# Altium schematic sheet PDB.SchDoc
size A4; SheetNumber: 1; SheetTotal: 3
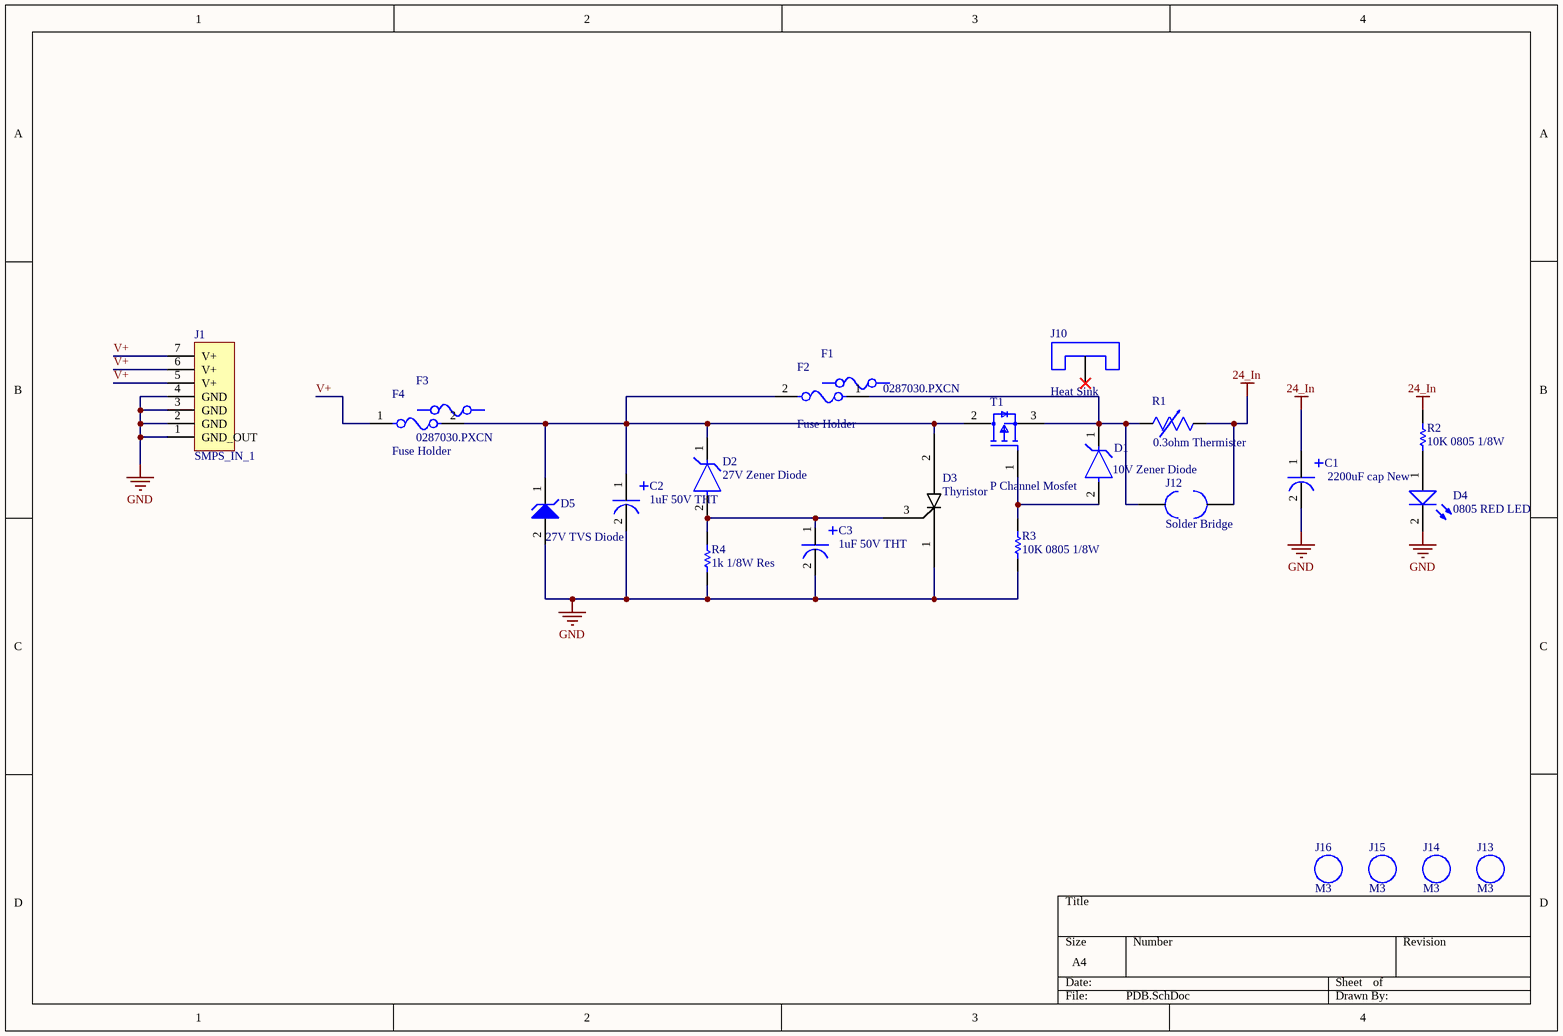
[diagram p0: PDB.SchDoc]

## Parts
C1  2200uF cap New  [Capacitor through hole]
C2  1uF 50V THT  [capacitor Through Hole Small]
C3  1uF 50V THT  [capacitor Through Hole Small]
D1  10V Zener Diode  [27V Zener diode]
D2  27V Zener Diode  [27V Zener diode]
D3  Thyristor  [Thyristor]
D4  0805 RED LED  [0805 LED]
D5  27V TVS Diode  [27V TVS Diode]
F1  0287030.PXCN  [FP-0287-MFG]  (mechanical)
F2  Fuse Holder  [FUSE HOLDER]
F3  0287030.PXCN  [FP-0287-MFG]  (mechanical)
F4  Fuse Holder  [FUSE HOLDER]
J1  SMPS_IN_1  [7 LUG PIN HEADER]
J10  Heat Sink  [Heat Sink]
J12  Solder Bridge  [1206]
J13  M3  [M3]
J14  M3  [M3]
J15  M3  [M3]
J16  M3  [M3]
R1  0.3ohm Thermister  [thermistor]
R2  10K 0805 1/8W  [0805 1K Resistor]
R3  10K 0805 1/8W  [0805 1K Resistor]
R4  1k 1/8W Res  [0805 1K Resistor]
T1  P Channel Mosfet  [P-Ch Mosfet]

## Nets
24_In: C1.1 J12.2 R1.1 R2.2
GND: C1.2 C2.2 C3.2 D3.1 D4.2(K) D5.2(A) J1.1(GND_OUT) J1.2(GND) J1.3(GND) J1.4(GND) R3.1 R4.1
V+: F4.1 J1.5(V+) J1.6(V+) J1.7(V+)
NetC2_1: C2.1 D2.1(C) D3.2 D5.1(K) F2.2 F4.2 T1.2(D)
NetC3_1: C3.1 D2.2(A) D3.3 R4.2
NetD1_1: D1.1(C) F2.1 J12.1 R1.2 T1.3(S)
NetD1_2: D1.2(A) R3.2 T1.1(G)
NetD4_1: D4.1(A) R2.1

Not connected (* = marked no-connect by the designer): J10 1*

## Library data of the parts
C1 = MAL214851222E3: Radial Can ALUMINUM ELECTROLYTIC CAPACITOR 148RUS 50V 2200muF ±20% 0.630Dia 16.00mm; Manufacturer: Vishay; Value: 2.2mF; Impedance: 39mΩ; Lead Diameter: 800µm; Leakage Current: 1.1mA; Life (Hours): 3000hours; Polarity: Polar; Ripple Current: 1.52A; Supplier: Avnet; Supplier Part Number: 40Y2495; Manufacturer Part Number: MAL214851222E3; RoHS: Compliant; Category: Aluminum Electrolytic Capacitors; Stock: 25; Pricing: 1=5.04, 10=3.42, 25=3.22, 50=3.02, 100=2.82 (USD); Case/Package: Radial; China RoHS: Compliant; Diameter: 16mm; Height: 31mm; Height - Seated (Max): 33.5026mm; Lead Pitch: 7.5mm; Length: 31mm; Lifecycle Status: Production; Max Operating Temperature: 105°C; Min Operating Temperature: -40°C; Mounting Technology: Through Hole; Number of Terminals: 2; Packaging: Bulk; Radiation Hardening: No; REACH SVHC: Yes; Terminal Pitch: 7.5mm; Termination: Radial; Tolerance: 20%; Voltage Rating: 50V; Voltage Rating (DC): 50V; ComponentLink1URL: https://datasheet.octopart.com:443/MAL214851222E3-Vishay-datasheet-159617121.pdf?src-supplier=IHS; ComponentLink1Description: https://datasheet.octopart.com:443/MAL214851222E3-Vishay-datasheet-159617121.pdf?src-supplier=IHS; ComponentLink2URL: https://datasheet.octopart.com:443/MAL214851222E3-Vishay-datasheet-62320647.pdf?src-supplier=Farnell; ComponentLink2Description: https://datasheet.octopart.com:443/MAL214851222E3-Vishay-datasheet-62320647.pdf?src-supplier=Farnell; ComponentLink3URL: https://datasheet.octopart.com:443/MAL214851222E3-Vishay-datasheet-37143530.pdf?src-supplier=Newark; ComponentLink3Description: https://datasheet.octopart.com:443/MAL214851222E3-Vishay-datasheet-37143530.pdf?src-supplier=Newark; ComponentLink4URL: http://sigma.octopart.com:80/rohs_statement/Vishay-company-15.pdf?src-supplier=Compliance+Statements; ComponentLink4Description: http://sigma.octopart.com:80/rohs_statement/Vishay-company-15.pdf?src-supplier=Compliance+Statements; LCSC Part No: C1601121
C2 C3 = 50YXF1MEFC5X11: 1uF 50V ±20% Plugin, D5xL11mm Aluminum Electrolytic Capacitors - Leaded ROHS; Manufacturer: Rubycon; Value: 1µF; Impedance: 4Ω; Leakage Current: 3µA; Life (Hours): 5000hours; Ripple Current: 10.5mA; Supplier: Farnell; Supplier Part Number: 50YXF1MEFC5X11; Manufacturer Part Number: 50YXF1MEFC5X11; RoHS: Compliant; Category: Aluminum Electrolytic Capacitors; Pricing: 5=0.121, 50=0.082, 250=0.0753, 500=0.0664 (GBP); Case/Package: Radial; Diameter: 5mm; Height: 11mm; Height - Seated (Max): 12.4968mm; Lead Pitch: 2mm; Length: 11mm; Lifecycle Status: Obsolete; Max Operating Temperature: 105°C; Min Operating Temperature: -40°C; Mounting Technology: Through Hole; Number of Terminals: 2; Packaging: Bulk; Radiation Hardening: No; REACH SVHC: Yes; Terminal Pitch: 2mm; Termination: Radial; Tolerance: 20%; Voltage Rating: 50V; Voltage Rating (DC): 50V; ComponentLink1URL: https://datasheet.octopart.com:443/50YXF1MEFC5X11-Rubycon-datasheet-182101233.pdf?src-supplier=IHS; ComponentLink1Description: https://datasheet.octopart.com:443/50YXF1MEFC5X11-Rubycon-datasheet-182101233.pdf?src-supplier=IHS; ComponentLink2URL: https://datasheet.octopart.com:443/50YXF1MEFC5X11-Rubycon-datasheet-86451560.pdf?src-supplier=Master+Electronics; ComponentLink2Description: https://datasheet.octopart.com:443/50YXF1MEFC5X11-Rubycon-datasheet-86451560.pdf?src-supplier=Master+Electronics; ComponentLink3URL: https://datasheet.octopart.com:443/50YXF1MEFC5X11-Rubycon-datasheet-12512315.pdf?src-supplier=LKR; ComponentLink3Description: https://datasheet.octopart.com:443/50YXF1MEFC5X11-Rubycon-datasheet-12512315.pdf?src-supplier=LKR; ComponentLink4URL: https://datasheet.octopart.com:443/50YXF1MEFC5X11-Rubycon-datasheet-41194730.pdf?src-supplier=Newark; ComponentLink4Description: https://datasheet.octopart.com:443/50YXF1MEFC5X11-Rubycon-datasheet-41194730.pdf?src-supplier=Newark; ComponentLink5URL: https://datasheet.octopart.com:443/50YXF1MEFC5X11-Rubycon-datasheet-11966930.pdf?src-supplier=Newark; ComponentLink5Description: https://datasheet.octopart.com:443/50YXF1MEFC5X11-Rubycon-datasheet-11966930.pdf?src-supplier=Newark; ComponentLink6URL: https://datasheet.octopart.com:443/50YXF1MEFC5X11-Rubycon-datasheet-10032391.pdf?src-supplier=Newark; ComponentLink6Description: https://datasheet.octopart.com:443/50YXF1MEFC5X11-Rubycon-datasheet-10032391.pdf?src-supplier=Newark; ComponentLink7URL: https://datasheet.octopart.com:443/50YXF1MEFC5X11-Rubycon-datasheet-8447018.pdf?src-supplier=Newark; ComponentLink7Description: https://datasheet.octopart.com:443/50YXF1MEFC5X11-Rubycon-datasheet-8447018.pdf?src-supplier=Newark; ComponentLink8URL: https://datasheet.octopart.com:443/50YXF1MEFC5X11-Rubycon-datasheet-5377913.pdf?src-supplier=Newark; ComponentLink8Description: https://datasheet.octopart.com:443/50YXF1MEFC5X11-Rubycon-datasheet-5377913.pdf?src-supplier=Newark; ComponentLink9Description: New link; ComponentLink9URL: *; LCSC Part No: C2927584
D1 = SMBJ5347B-TP: Zener Diode Independent 10V 5W Surface Mount SMB(DO-214AA; Manufacturer: MCC; Manufacturer Part Number: 3SMBJ5925B-TP; Element Configuration: Single; Forward Current: 200mA; Forward Voltage: 1.5V; Impedance: 4.5Ω; Max Power Dissipation: 3W; Max Reverse Leakage Current: 5µA; Number of Elements: 1; Peak Reverse Current: 5nA; Polarity: Unidirectional; Test Current: 37.5mA; Tolerance: 5%; Supplier: DigiKey; Supplier Part Number: 3SMBJ5925B-TPMSCT-ND; RoHS: Compliant; Category: Zener Diodes; Stock: 312932; Pricing: 1=0.49, 10=0.301, 100=0.1903, 500=0.14234, 1000=0.12681 (USD); China RoHS: Non-Compliant; Composition: Zener; Country of Origin: Mainland China, Vietnam; Export Control Classification Number (ECCN) Code: EAR99; Height: 2.44mm; Harmonized Tariff Schedule (HTS) Code: 8541.10.00.50; Introduction Date: 2007-02-15; Length: 4.7mm; Lifecycle Status: Production; Max Operating Temperature: 150°C; Min Operating Temperature: -55°C; Mounting Technology: Surface Mount; Pins: 2; Number of Terminals: 2; Power Dissipation: 3W; REACH SVHC: No; Reference Voltage: 10V; Voltage Tolerance: 5%; Width: 3.94mm; Zener Current: 37.5mA; Zener Voltage: 10V; ComponentLink1URL: https://datasheet.octopart.com:443/3SMBJ5925B-TP-MCC-datasheet-188909281.pdf?src-supplier=TME; ComponentLink1Description: https://datasheet.octopart.com:443/3SMBJ5925B-TP-MCC-datasheet-188909281.pdf?src-supplier=TME; ComponentLink2URL: https://datasheet.octopart.com:443/3SMBJ5925B-TP-MCC-datasheet-9573749.pdf?src-supplier=RS+(Formerly+Allied+Electronics); ComponentLink2Description: https://datasheet.octopart.com:443/3SMBJ5925B-TP-MCC-datasheet-9573749.pdf?src-supplier=RS+(Formerly+Allied+Electronics); LCSC Part No: C151743
D2 = SMBJ5361B-TP: Zener Diode, 27V, 5W, Do-214Aa Rohs Compliant: Yes |Micro Commercial Components SMBJ5361B-TP; Manufacturer: MCC; Element Configuration: Single; Forward Voltage: 1.2V; Impedance: 5Ω; Max Junction Temperature (Tj): 150°C; Max Reverse Leakage Current: 500nA; Number of Elements: 1; Peak Reverse Current: 500pA; Polarity: Unidirectional; Reverse Voltage: 20.6V; Test Current: 50mA; Tolerance: 5%; Supplier: Arrow Electronics; Supplier Part Number: SMBJ5361B-TP; Manufacturer Part Number: SMBJ5361B-TP; RoHS: Compliant; Category: Zener Diodes; Stock: 5; Pricing: 1=0.1196 (USD); Case/Package: SMB; China RoHS: Non-Compliant; Composition: Zener; Country of Origin: Mainland China, Vietnam; Export Control Classification Number (ECCN) Code: EAR99; Height: 2.82mm; Harmonized Tariff Schedule (HTS) Code: 8541.10.00.50; Introduction Date: 2002-04-11; Lead Free: Lead Free; Lifecycle Status: Production; Max Operating Temperature: 150°C; Max Power Dissipation: 5W; Min Operating Temperature: -55°C; Mounting Technology: Surface Mount; Pins: 2; Number of Terminals: 2; Power Dissipation: 5W; Radiation Hardening: No; REACH SVHC: No; Reference Voltage: 27V; Schedule B: 8541100050, 8541100050|8541100050|8541100050|8541100050|8541100050; Voltage Tolerance: 5%; Working Voltage: 27V; Zener Current: 50mA; Zener Voltage: 27V; ComponentLink1URL: https://datasheet.octopart.com:443/SMBJ5361B-TP-MCC-datasheet-179878967.pdf?src-supplier=element14+APAC; ComponentLink1Description: https://datasheet.octopart.com:443/SMBJ5361B-TP-MCC-datasheet-179878967.pdf?src-supplier=element14+APAC; ComponentLink2URL: https://datasheet.octopart.com:443/SMBJ5361B-TP-MCC-datasheet-133521239.pdf?src-supplier=Future+Electronics; ComponentLink2Description: https://datasheet.octopart.com:443/SMBJ5361B-TP-MCC-datasheet-133521239.pdf?src-supplier=Future+Electronics; ComponentLink3URL: https://datasheet.octopart.com:443/SMBJ5361B-TP-MCC-datasheet-13563501.pdf?src-supplier=HQonline; ComponentLink3Description: https://datasheet.octopart.com:443/SMBJ5361B-TP-MCC-datasheet-13563501.pdf?src-supplier=HQonline; ComponentLink4URL: https://datasheet.octopart.com:443/SMBJ5361B-TP-MCC-datasheet-12511215.pdf?src-supplier=Factory+Futures; ComponentLink4Description: https://datasheet.octopart.com:443/SMBJ5361B-TP-MCC-datasheet-12511215.pdf?src-supplier=Factory+Futures; ComponentLink5URL: https://datasheet.octopart.com:443/SMBJ5361B-TP-MCC-datasheet-11551749.pdf?src-supplier=Arrow+Electronics; ComponentLink5Description: https://datasheet.octopart.com:443/SMBJ5361B-TP-MCC-datasheet-11551749.pdf?src-supplier=Arrow+Electronics; LCSC Part No: C3730541
D3 = TN4015H-6I: SCR 600 V 40 A Standard Recovery Through Hole TO-220; Manufacturer: STMicroelectronics; Hold Current: 60mA; Leakage Current: 10µA; Max Junction Temperature (Tj): 150°C; Max Repetitive Reverse Voltage (Vrrm): 600V; Max RMS Current: 40A; Number of Elements: 1; Peak Non-Repetitive Surge Current: 360A; Supplier: Arrow Electronics; Supplier Part Number: TN4015H-6I; Manufacturer Part Number: TN4015H-6I; RoHS: Compliant; Category: Thyristors; Stock: 1000; Pricing: 1000=0.6362 (USD); China RoHS: Non-Compliant; Country of Origin: Mainland China; Export Control Classification Number (ECCN) Code: EAR99; Harmonized Tariff Schedule (HTS) Code: 8541.30.00.80; Introduction Date: 2016-11-28; Lifecycle Status: Production; Max Operating Temperature: 150°C; Min Operating Temperature: -40°C; Number of Terminals: 3; REACH SVHC: No; Schedule B: 8541300080; ComponentLink1URL: https://datasheet.octopart.com:443/TN4015H-6I-STMicroelectronics-datasheet-67304264.pdf?src-supplier=STMicroelectronics; ComponentLink1Description: https://datasheet.octopart.com:443/TN4015H-6I-STMicroelectronics-datasheet-67304264.pdf?src-supplier=STMicroelectronics; ComponentLink2URL: https://datasheet.octopart.com:443/TN4015H-6I-STMicroelectronics-datasheet-78772670.pdf?src-supplier=TME; ComponentLink2Description: https://datasheet.octopart.com:443/TN4015H-6I-STMicroelectronics-datasheet-78772670.pdf?src-supplier=TME; LCSC Part No: C5269098
D4 = SML-LXT0805IW-TR: Led; Red; 11MCD; 0.061IN.DIA.; SMD; 100MA; 2V Vf; 635NM; 140DEG; SMD; White Diffused; 5V Vr; Manufacturer: Lumex; Approvals: CSA, UL; Forward Current: 30mA; Forward Voltage: 2.5V; Number of Circuits: 1; Power Dissipation: 48mW; Shape: Rectangular; Test Current: 20mA; Viewing Angle: 140°; Wavelength: 628nm; Supplier: DigiKey; Supplier Part Number: 67-1552-1-ND; Manufacturer Part Number: SML-LXT0805IW-TR; RoHS: Compliant; Category: LEDs; Stock: 136451; Pricing: 1=0.2, 10=0.138, 100=0.0958, 500=0.07648, 1000=0.07007, 2000=0.06459 (USD); Case/Package: 0805; Case Code (Imperial): 0805; Case Code (Metric): 2012; China RoHS: Compliant; Color: Red; Country of Origin: Taiwan; Dominant Wavelength: 635nm; Export Control Classification Number (ECCN) Code: EAR99; Height: 800µm; Harmonized Tariff Schedule (HTS) Code: 8541.40.20.00; Illumination Color: Red; Introduction Date: 2001-01-08; Length: 2mm; Lens Color: White; Lens Style: Diffused; Lens Transparency: Diffused; Lifecycle Status: Production; Luminous Intensity: 11mcd; Max Operating Temperature: 80°C; Min Operating Temperature: -25°C; Mounting Technology: Surface Mount; Number of LEDs: 1; Pins: 2; Number of Terminals: 2; Packaging: Cut Tape; Peak Wavelength: 635nm; REACH SVHC: Yes; Reverse Voltage: 5V; Schedule B: 8541402000, 8541402000|8541402000|8541402000|8541402000|8541402000|8541402000|8541402000|8541402000|8541402000|8541402000|8541402000|8541402000|8541402000|8541402000|8541402000|8541402000|8541402000|8541402000|8541402000|8541402000|8541402000|8541402000|8541402000|85, 8541410000; Terminal Pitch: 2.1mm; Width: 1.25mm; ComponentLink1URL: https://datasheet.octopart.com:443/SML-LXT0805IW-TR-Lumex-datasheet-96443416.pdf?src-supplier=JRH+Electronics; ComponentLink1Description: https://datasheet.octopart.com:443/SML-LXT0805IW-TR-Lumex-datasheet-96443416.pdf?src-supplier=JRH+Electronics; ComponentLink2URL: https://datasheet.octopart.com:443/SML-LXT0805IW-TR-Lumex-datasheet-158251.pdf?src-supplier=Newark; ComponentLink2Description: https://datasheet.octopart.com:443/SML-LXT0805IW-TR-Lumex-datasheet-158251.pdf?src-supplier=Newark; ComponentLink3URL: https://datasheet.octopart.com:443/SML-LXT0805IW-TR-Lumex-datasheet-43153349.pdf?src-supplier=Electro+Sonic; ComponentLink3Description: https://datasheet.octopart.com:443/SML-LXT0805IW-TR-Lumex-datasheet-43153349.pdf?src-supplier=Electro+Sonic; ComponentLink4URL: https://datasheet.octopart.com:443/SML-LXT0805IW-TR.-Lumex-datasheet-17067.pdf?src-supplier=DigiKey; ComponentLink4Description: https://datasheet.octopart.com:443/SML-LXT0805IW-TR.-Lumex-datasheet-17067.pdf?src-supplier=DigiKey; ComponentLink5URL: https://datasheet.octopart.com:443/SML-LXT0805IW-TR-Lumex-datasheet-9793472.pdf?src-supplier=RS+(Formerly+Allied+Electronics); ComponentLink5Description: https://datasheet.octopart.com:443/SML-LXT0805IW-TR-Lumex-datasheet-9793472.pdf?src-supplier=RS+(Formerly+Allied+Electronics); ComponentLink6URL: https://datasheet.octopart.com:443/SML-LXT0805IW-TR-Lumex-datasheet-86237.pdf?src-supplier=RS+(Formerly+Allied+Electronics); ComponentLink6Description: https://datasheet.octopart.com:443/SML-LXT0805IW-TR-Lumex-datasheet-86237.pdf?src-supplier=RS+(Formerly+Allied+Electronics); LCSC Part No: C19171391
D5 = P6KE27ARLG: 600 Watt SUR40 Transient Voltage Suppressor, 27 V, Unidirectional; Manufacturer: onsemi; Breakdown Voltage: 27.05V; Clamping Voltage: 37.5V; Element Configuration: Single; Leakage Current: 5µA; Max Breakdown Voltage: 28.4V; Max Power Dissipation: 5W; Max Surge Current: 16A; Min Breakdown Voltage: 25.7V; Number of Channels: 1; Operating Supply Voltage: 23.1V; Peak Pulse Power: 600W; Power Line Protection: No; Test Current: 1mA; Supplier: Bison Technologies; Supplier Part Number: P6KE27ARLG-158866; Manufacturer Part Number: P6KE27ARLG; RoHS: Compliant; Category: TVS Diodes; Stock: 5900; Pricing: 100=0.06, 1000=0.06, 10000=0.06 (USD); Case/Package: Axial; China RoHS: Non-Compliant; Composition: Zener; Contact Plating: Tin; Country of Origin: Mainland China; Direction: Unidirectional; Export Control Classification Number (ECCN) Code: EAR99; Harmonized Tariff Schedule (HTS) Code: 8541.10.00.50; Introduction Date: 1999-01-01; Lead Free: Lead Free; Max Operating Temperature: 150°C; Max Reverse Leakage Current: 5µA; Min Operating Temperature: -55°C; Number of Elements: 1; Pins: 2; Number of Terminals: 2; Number of Unidirectional Channels: 1; Packaging: Tape and Reel; Peak Pulse Current: 16A; Polarity: Unidirectional; Power Dissipation: 600W; Radiation Hardening: No; REACH SVHC: No; Reverse Breakdown Voltage: 25.7V; Reverse Standoff Voltage: 23.1V; Termination: Axial; ComponentLink1URL: https://datasheet.octopart.com:443/P6KE27ARLG-ON-Semiconductor-datasheet-8361193.pdf?src-supplier=IHS; ComponentLink1Description: https://datasheet.octopart.com:443/P6KE27ARLG-ON-Semiconductor-datasheet-8361193.pdf?src-supplier=IHS; ComponentLink2URL: https://datasheet.octopart.com:443/P6KE27ARLG-ON-Semiconductor-datasheet-5320614.pdf?src-supplier=onsemi; ComponentLink2Description: https://datasheet.octopart.com:443/P6KE27ARLG-ON-Semiconductor-datasheet-5320614.pdf?src-supplier=onsemi; ComponentLink3URL: https://datasheet.octopart.com:443/P6KE27ARLG-onsemi-datasheet-79626349.pdf?src-supplier=Farnell; ComponentLink3Description: https://datasheet.octopart.com:443/P6KE27ARLG-onsemi-datasheet-79626349.pdf?src-supplier=Farnell; ComponentLink4URL: http://sigma.octopart.com:80/reach_statement/ON-Semiconductor-company-79.pdf?src-supplier=Compliance+Statements; ComponentLink4Description: http://sigma.octopart.com:80/reach_statement/ON-Semiconductor-company-79.pdf?src-supplier=Compliance+Statements; ComponentLink5URL: https://octopart.com:443/opatz8j6/c1?t=2cJTaBfKdbaYfiIibkn32kFJN2rkQAxk7M-zdmCFLNYhDS4Q_M0VQkaOAo5Ijtsf6TEss0vlvxYVSuDQTRZP4OvQV2pXsbQ98v0s9K6hdiFStXveO6nhAUnzDXp5xHxKIFKd8f_nnKbZC-l5hdBFgFSLLzjiWU1mRDFWwLSmSyFNQzmDyJ0WyQpSZN_85hCm8lhg27LncNlkqwz2W0BQiMb47LSU24ywtnWJBrffDSUFoIOy5DRvi26unpeOfRJUZq5vb6J1HvpVsqMMnuUvQDgpfylJ3jskX1SzE2wqL06L0laSWrQj0crcyI1tb60BYAje57qsLb2d2LwrmFq9ygYxyN3BPTigX2aIOQ&src-supplier=Compliance+Statements; ComponentLink5Description: https://octopart.com:443/opatz8j6/c1?t=2cJTaBfKdbaYfiIibkn32kFJN2rkQAxk7M-zdmCFLNYhDS4Q_M0VQkaOAo5Ijtsf6TEss0vlvxYVSuDQTRZP4OvQV2pXsbQ98v0s9K6hdiFStXveO6nhAUnzDXp5xHxKIFKd8f_nnKbZC-l5hdBFgFSLLzjiWU1mRDFWwLSmSyFNQzmDyJ0WyQpSZN_85hCm8lhg27LncNlkqwz2W0BQiMb47LSU24ywtnWJBrffDSUFoIOy5DRvi26unpeOfRJUZq5vb6J1HvpVsqMMnuUvQDgpfylJ3jskX1SzE2wqL06L0laSWrQj0crcyI1tb60BYAje57qsLb2d2LwrmFq9ygYxyN3BPTigX2aIOQ&src-supplier=Compliance+Statements; LCSC Part No: C3707914
F1 F3 = CMP-08605-000065-1: FUSE AUTOMOTIVE 30A 32VDC BLADE; Manufacturer: Littelfuse Inc; Max Fuse Dc Voltage: 32V; Fuse Voltage Drop: 84mV; Fuse I2T: 1510A2Sec; Fuse Blow Speed: Medium; Resistance: 1.97mΩ; Value: 1.97mΩ; Fuse Interrupt Dc Current: 1000A; Fuse Current: 30A; Device Class L2: Fuses; Octopart: https://octopart.com/0287030.pxcn-littelfuse-19644293; Device Class L3: unset; Voltage Rating: 32V; RoHS: TRUE; ComponentLink2Description: Datasheet; Device Class L1: Circuit Protection; Ambient Temperature Range High: +105°C; ComponentLink2URL: https://www.littelfuse.com/~/media/automotive/datasheets/fuses/passenger-car-and-commercial-vehicle/blade-fuses/littelfuse_atof_datasheet.pdf; Automotive: Yes; Lead Free: Yes; Ambient Temperature Range Low: -40°C; Manufacturer Part Number: 0287030.PXCN; Mouser Description: Automotive Fuses ATOF 32V 30A Low-Current Nylon; Package: 0287; Category: Fuse; Digikey Description: FUSE AUTOMOTIVE 30A 32VDC BLADE; LCSC Part No: C142686
F2 F4 = 3568: Holder; Fuse; Auto Blade; Mini; 500VAC; 30A; PC Pin Terminal; Nylon 4/6 Holder; Black; Manufacturer: Keystone; Approvals: UL; Current Rating: 20A; Illumination Type: Illuminated; Material: Brass, Nylon, Tin; Number of Circuits: 1; Voltage: 500V; Supplier: Future Electronics; Supplier Part Number: 3568; Manufacturer Part Number: 3568; RoHS: Compliant; Category: Fuse Holders; Stock: 77707; Pricing: 30=0.74, 100=0.72, 250=0.71, 1000=0.69, 2500=0.66 (USD); Body Material: Nylon; Color: Black; Contact Material: Brass; Contact Plating: Tin; Country of Origin: USA; Depth: 6.73mm; Flammability Rating: UL94 V-0; Fuse Current: 20A; Introduction Date: 2015-08-28; Lead Free: Lead Free; Length: 16mm; Lifecycle Status: Production; Max Operating Temperature: 145°C; Min Operating Temperature: -50°C; Mounting Technology: PCB, Vertical; Number of Poles: 1; Orientation: Vertical; REACH SVHC: Yes; Termination: PC Pin; Voltage Rating (AC): 500V; ComponentLink1URL: https://datasheet.octopart.com:443/3568-Keystone-datasheet-137335555.pdf?src-supplier=Upverter; ComponentLink1Description: https://datasheet.octopart.com:443/3568-Keystone-datasheet-137335555.pdf?src-supplier=Upverter; ComponentLink2URL: https://datasheet.octopart.com:443/3568-Keystone-datasheet-15715963.pdf?src-supplier=Future+Electronics; ComponentLink2Description: https://datasheet.octopart.com:443/3568-Keystone-datasheet-15715963.pdf?src-supplier=Future+Electronics; ComponentLink3URL: https://datasheet.octopart.com:443/3568-Keystone-datasheet-7589202.pdf?src-supplier=Future+Electronics; ComponentLink3Description: https://datasheet.octopart.com:443/3568-Keystone-datasheet-7589202.pdf?src-supplier=Future+Electronics; ComponentLink4URL: https://datasheet.octopart.com:443/3568-Keystone-datasheet-137916591.pdf?src-supplier=Future+Electronics; ComponentLink4Description: https://datasheet.octopart.com:443/3568-Keystone-datasheet-137916591.pdf?src-supplier=Future+Electronics; ComponentLink5URL: https://datasheet.octopart.com:443/3568-Keystone-datasheet-21202853.pdf?src-supplier=element14+APAC; ComponentLink5Description: https://datasheet.octopart.com:443/3568-Keystone-datasheet-21202853.pdf?src-supplier=element14+APAC; ComponentLink6URL: https://datasheet.octopart.com:443/3568-Keystone-datasheet-10928834.pdf?src-supplier=RS+(Formerly+Allied+Electronics); ComponentLink6Description: https://datasheet.octopart.com:443/3568-Keystone-datasheet-10928834.pdf?src-supplier=RS+(Formerly+Allied+Electronics); ComponentLink7URL: https://datasheet.octopart.com:443/3568-Keystone-datasheet-110727069.pdf?src-supplier=RS+(Formerly+Allied+Electronics); ComponentLink7Description: https://datasheet.octopart.com:443/3568-Keystone-datasheet-110727069.pdf?src-supplier=RS+(Formerly+Allied+Electronics); ComponentLink8URL: https://datasheet.octopart.com:443/3568-Keystone-datasheet-17577430.pdf?src-supplier=TME; ComponentLink8Description: https://datasheet.octopart.com:443/3568-Keystone-datasheet-17577430.pdf?src-supplier=TME; LCSC Part No: C5249699
J1 = Terminal Connectors 6: 5.08mm Pitch Eurostyle Vertical Fixed Mount PCB Terminal Block, 6 Circuits; Manufacturer: Molex; Manufacturer Part Number: 39544-3006; Manufacturer Lifecycle Status: ACTIVE; Approvals: UL, cUL; Current Rating: 15A; Number of Circuits: 5; Number of Contacts: 6; Number of Levels: 1; Voltage Rating: 300V; Wire/Cable Gauge: 12AWG; Supplier: Arrow Electronics; Supplier Part Number: 0395443006; RoHS: Compliant; Category: Terminal Blocks; Stock: 960; Pricing: 1=2.8662, 10=2.1815, 25=1.9364, 50=1.7714, 100=1.6311, 480=1.4072, 960=1.353 (USD); China RoHS: Compliant; Color: Black; Contact Material: Brass; Contact Plating: Tin; Country of Origin: US; Export Control Classification Number (ECCN) Code: EAR99; ELV: Compliant; Flammability Rating: UL94 V-0; Halogen Free: Low Halogen; Height: 14.4mm; Housing Color: Black; Housing Material: Nylon; Harmonized Tariff Schedule (HTS) Code: 8536.90.40.00; Introduction Date: 2007-04-03; Lead Free: Lead Free; Length: 30.48mm; Lifecycle Status: Production; Max Operating Temperature: 105°C; Min Operating Temperature: -40°C; Mounting Technology: Screw; Pins: 6; Number of Positions: 6; Number of Rows: 1; Orientation: Vertical; Packaging: Bulk; Pitch: 5.08mm; REACH SVHC: No; Schedule B: 8536695050, 8536695050|8536695050|8536695050|8536695050|8536695050; Termination: Solder; ComponentLink1URL: https://datasheet.octopart.com:443/395443006-Molex-datasheet-138897636.pdf?src-supplier=IHS; ComponentLink1Description: https://datasheet.octopart.com:443/395443006-Molex-datasheet-138897636.pdf?src-supplier=IHS; ComponentLink2URL: https://datasheet.octopart.com:443/39544-3006-Molex-datasheet-15647497.pdf?src-supplier=Molex; ComponentLink2Description: https://datasheet.octopart.com:443/39544-3006-Molex-datasheet-15647497.pdf?src-supplier=Molex; ComponentLink3URL: https://datasheet.octopart.com:443/395443006-Molex-datasheet-8340186.pdf?src-supplier=Molex; ComponentLink3Description: https://datasheet.octopart.com:443/395443006-Molex-datasheet-8340186.pdf?src-supplier=Molex; ComponentLink4URL: https://datasheet.octopart.com:443/39544-3006-Molex-datasheet-193100652.pdf?src-supplier=JRH+Electronics; ComponentLink4Description: https://datasheet.octopart.com:443/39544-3006-Molex-datasheet-193100652.pdf?src-supplier=JRH+Electronics; ComponentLink5URL: https://datasheet.octopart.com:443/39544-3006-Molex-datasheet-101582495.pdf?src-supplier=Farnell; ComponentLink5Description: https://datasheet.octopart.com:443/39544-3006-Molex-datasheet-101582495.pdf?src-supplier=Farnell; ComponentLink6URL: https://datasheet.octopart.com:443/39544-3006-Molex-datasheet-154750061.pdf?src-supplier=Master+Electronics; ComponentLink6Description: https://datasheet.octopart.com:443/39544-3006-Molex-datasheet-154750061.pdf?src-supplier=Master+Electronics; ComponentLink7URL: https://datasheet.octopart.com:443/39544-3006-Molex-datasheet-62280869.pdf?src-supplier=Electro+Sonic; ComponentLink7Description: https://datasheet.octopart.com:443/39544-3006-Molex-datasheet-62280869.pdf?src-supplier=Electro+Sonic; ComponentLink8URL: https://datasheet.octopart.com:443/39544-3006-Molex-datasheet-44402560.pdf?src-supplier=Electro+Sonic; ComponentLink8Description: https://datasheet.octopart.com:443/39544-3006-Molex-datasheet-44402560.pdf?src-supplier=Electro+Sonic; ComponentLink9URL: https://datasheet.octopart.com:443/39544-3006-Molex-datasheet-34199391.pdf?src-supplier=Newark; ComponentLink9Description: https://datasheet.octopart.com:443/39544-3006-Molex-datasheet-34199391.pdf?src-supplier=Newark; ComponentLink10URL: https://datasheet.octopart.com:443/39544-3006-Molex-datasheet-33003022.pdf?src-supplier=Newark; ComponentLink10Description: https://datasheet.octopart.com:443/39544-3006-Molex-datasheet-33003022.pdf?src-supplier=Newark; ComponentLink11URL: https://datasheet.octopart.com:443/39544-3006-Molex-datasheet-21207647.pdf?src-supplier=Newark; ComponentLink11Description: https://datasheet.octopart.com:443/39544-3006-Molex-datasheet-21207647.pdf?src-supplier=Newark; ComponentLink12URL: https://datasheet.octopart.com:443/39544-3006-Molex-datasheet-5315843.pdf?src-supplier=Verical; ComponentLink12Description: https://datasheet.octopart.com:443/39544-3006-Molex-datasheet-5315843.pdf?src-supplier=Verical; ComponentLink13URL: https://datasheet.octopart.com:443/39544-3006-Molex-datasheet-118853.pdf?src-supplier=DigiKey; ComponentLink13Description: https://datasheet.octopart.com:443/39544-3006-Molex-datasheet-118853.pdf?src-supplier=DigiKey; ComponentLink14URL: https://datasheet.octopart.com:443/39544-3006-Molex-datasheet-20203.pdf?src-supplier=element14; ComponentLink14Description: https://datasheet.octopart.com:443/39544-3006-Molex-datasheet-20203.pdf?src-supplier=element14; ComponentLink15URL: http://sigma.octopart.com:80/15647498/rohs_certificate/Molex-39544-3006.pdf?src-supplier=Compliance+Statements; ComponentLink15Description: http://sigma.octopart.com:80/15647498/rohs_certificate/Molex-39544-3006.pdf?src-supplier=Compliance+Statements; ComponentLink16URL: http://sigma.octopart.com:80/reach_statement/Molex-company-74.pdf?src-supplier=Compliance+Statements; ComponentLink16Description: http://sigma.octopart.com:80/reach_statement/Molex-company-74.pdf?src-supplier=Compliance+Statements; ComponentLink17URL: http://sigma.octopart.com:80/rohs_statement/Molex-company-73.pdf?src-supplier=Compliance+Statements; ComponentLink17Description: http://sigma.octopart.com:80/rohs_statement/Molex-company-73.pdf?src-supplier=Compliance+Statements; ComponentLink18URL: http://sigma.octopart.com:80/conflict_mineral_statement/Molex-company-72.pdf?src-supplier=Compliance+Statements; ComponentLink18Description: http://sigma.octopart.com:80/conflict_mineral_statement/Molex-company-72.pdf?src-supplier=Compliance+Statements; LCSC Part No: C587506
J10 = 513001B02500G: TO-220 Package 13.4 C/W Thermal Resistance Large Radial Fin Heat Sink; Manufacturer: Aavid Thermalloy; Natural Thermal Resistance: 13.4°C/W; Shape: Fins, Rectangular; Thermal Resistance @ Forced Air Flow (100 LFM): 4°C/W; Supplier: Mouser; Supplier Part Number: 532-513001B25G; Manufacturer Part Number: 513001B02500G; RoHS: Compliant; Category: Heat Sinks; Stock: 6491; Pricing: 1=1.68, 10=1.53, 50=1.45, 100=1.37, 1000=1.09, 10000=1.08 (USD); Case/Package: TO-218; Color: Black; Depth: 12.7mm; Export Control Classification Number (ECCN) Code: EAR99; Height: 25.4mm; Height Off Base: 12.7mm; Harmonized Tariff Schedule (HTS) Code: 8541.90.00.00; Introduction Date: 2012-05-15; Lead Free: Lead Free; Length: 34.92mm; Lifecycle Status: Production; Material: Aluminium, Anodized; Mounting Technology: Through Hole; Packaging: Box; Type: Passive; Width: 12.7mm; ComponentLink1URL: https://datasheet.octopart.com:443/513001B02500G-Aavid-Thermalloy-datasheet-111182914.pdf?src-supplier=IHS; ComponentLink1Description: https://datasheet.octopart.com:443/513001B02500G-Aavid-Thermalloy-datasheet-111182914.pdf?src-supplier=IHS; ComponentLink2URL: https://datasheet.octopart.com:443/513001B02500G-Aavid-Thermalloy-datasheet-182190711.pdf?src-supplier=IHS; ComponentLink2Description: https://datasheet.octopart.com:443/513001B02500G-Aavid-Thermalloy-datasheet-182190711.pdf?src-supplier=IHS; ComponentLink3URL: https://datasheet.octopart.com:443/513001B02500G-Aavid-Thermalloy-datasheet-116638641.pdf?src-supplier=Sager+Electronics; ComponentLink3Description: https://datasheet.octopart.com:443/513001B02500G-Aavid-Thermalloy-datasheet-116638641.pdf?src-supplier=Sager+Electronics; ComponentLink4URL: https://datasheet.octopart.com:443/513001B02500G-Aavid-Thermalloy-datasheet-12547168.pdf?src-supplier=Future+Electronics; ComponentLink4Description: https://datasheet.octopart.com:443/513001B02500G-Aavid-Thermalloy-datasheet-12547168.pdf?src-supplier=Future+Electronics; ComponentLink5URL: https://datasheet.octopart.com:443/513001B02500G-Aavid-Thermalloy-datasheet-12511871.pdf?src-supplier=Future+Electronics; ComponentLink5Description: https://datasheet.octopart.com:443/513001B02500G-Aavid-Thermalloy-datasheet-12511871.pdf?src-supplier=Future+Electronics; ComponentLink6URL: http://sigma.octopart.com:80/conflict_mineral_statement/Aavid-Thermalloy-company-26.pdf?src-supplier=Compliance+Statements; ComponentLink6Description: http://sigma.octopart.com:80/conflict_mineral_statement/Aavid-Thermalloy-company-26.pdf?src-supplier=Compliance+Statements
R1 = SL320R230: NTC Thermistor, 0.3ohm, Through Hole Mount; Manufacturer: Vishay; Current Rating: 30A; Dissipation Factor: 45.4%; Lead Diameter: 1mm; Ratings: CSA; Value: 300mΩ; Tolerance: 25%; Supplier: DigiKey; Supplier Part Number: 570-SL320R230-ND; Manufacturer Part Number: SL320R230; RoHS: Compliant; Category: Resistors; Stock: 164; Pricing: 1=9.59, 5=7.958, 10=7.344, 50=6.0892, 100=5.6147, 250=5.0404, 500=4.64248, 1000=4.27324 (USD); Country of Origin: USA; Diameter: 31mm; Export Control Classification Number (ECCN) Code: EAR99; Height: 31mm; Harmonized Tariff Schedule (HTS) Code: 8533.40.80.70; Introduction Date: 2025-08-07; Lead Pitch: 7.8mm; Length: 31mm; Lifecycle Status: Production; Max Operating Temperature: 150°C; Min Operating Temperature: -40°C; Number of Terminals: 2; Packaging: Bulk; REACH SVHC: No; Width: 6mm; ComponentLink1URL: https://datasheet.octopart.com:443/SL320R230-Vishay-datasheet-189867316.pdf?src-supplier=Vishay; ComponentLink1Description: https://datasheet.octopart.com:443/SL320R230-Vishay-datasheet-189867316.pdf?src-supplier=Vishay; ComponentLink2URL: https://datasheet.octopart.com:443/SL320R230-Ametherm-datasheet-182141257.pdf?src-supplier=Sager+Electronics; ComponentLink2Description: https://datasheet.octopart.com:443/SL320R230-Ametherm-datasheet-182141257.pdf?src-supplier=Sager+Electronics; ComponentLink3URL: http://sigma.octopart.com:80/rohs_statement/Vishay-company-15.pdf?src-supplier=Compliance+Statements; ComponentLink3Description: http://sigma.octopart.com:80/rohs_statement/Vishay-company-15.pdf?src-supplier=Compliance+Statements; LCSC Part No: C3761746
R2 R3 = RC0805FR-0710KL: Res General Purpose Thick Film 0805 10k Ohm 1% 1/8W ±100ppm/°C Ceramic Paper T/R; Manufacturer: Yageo Group; Max Power Dissipation: 125mW; Value: 10kΩ; Voltage Rating: 150V; Supplier: Future Electronics; Supplier Part Number: RC0805FR-0710KL; Manufacturer Part Number: RC0805FR-0710KL; RoHS: Compliant; Category: Chip SMD Resistors; Stock: 2395000; Pricing: 10000=0.0017, 50000=0.0017, 150000=0.0016, 375000=0.0016, 1000000=0.0015 (USD); Case/Package: 0805; Case Code (Imperial): 0805; China RoHS: Non-Compliant; Composition: Thick Film; Contact Plating: Tin; Country of Origin: Mainland China, Taiwan; Depth: 1.25mm; Export Control Classification Number (ECCN) Code: EAR99; Features: Moisture Resistant; Height: 500µm; Harmonized Tariff Schedule (HTS) Code: 8533.21.00.30; Introduction Date: 2004-09-22; Lead Free: Lead Free; Length: 2mm; Lifecycle Status: Production; Max Operating Temperature: 155°C; Military Standard: Not; Min Operating Temperature: -55°C; Mounting Technology: Surface Mount; Pins: 2; Number of Terminals: 2; Number of Terminations: 2; Packaging: Tape and Reel; Power Rating: 125mW; Radiation Hardening: No; REACH SVHC: Yes; Schedule B: 8533210045, 8533210045|8533210045|8533210045|8533210045|8533210045|8533210045|8533210045|8533210045|8533210045|8533210045|8533210045|8533210045|8533210045|8533210045|8533210045|8533210045|8533210045|8533210045|8533210045|8533210045|8533210045|8533210045|8533210045|85; Temperature Coefficient: 100ppm/°C; Termination: SMD/SMT; Tolerance: 1%; Voltage Rating (AC): 150V; Voltage Rating (DC): 150V; Width: 1.25mm; Working Voltage: 150V; ComponentLink1URL: https://datasheet.octopart.com:443/RC0805FR-0710KL-Yageo-datasheet-175887523.pdf?src-supplier=Newark; ComponentLink1Description: https://datasheet.octopart.com:443/RC0805FR-0710KL-Yageo-datasheet-175887523.pdf?src-supplier=Newark; ComponentLink2URL: https://datasheet.octopart.com:443/RC0805FR-0710KL-Yageo-datasheet-62067350.pdf?src-supplier=Farnell; ComponentLink2Description: https://datasheet.octopart.com:443/RC0805FR-0710KL-Yageo-datasheet-62067350.pdf?src-supplier=Farnell; ComponentLink3URL: https://datasheet.octopart.com:443/RC0805FR-0710KL-Yageo-datasheet-13691069.pdf?src-supplier=Farnell; ComponentLink3Description: https://datasheet.octopart.com:443/RC0805FR-0710KL-Yageo-datasheet-13691069.pdf?src-supplier=Farnell; ComponentLink4URL: https://datasheet.octopart.com:443/RC0805FR-0710KL-Yageo-datasheet-103092701.pdf?src-supplier=Upverter; ComponentLink4Description: https://datasheet.octopart.com:443/RC0805FR-0710KL-Yageo-datasheet-103092701.pdf?src-supplier=Upverter; ComponentLink5URL: https://datasheet.octopart.com:443/RC0805FR-0710KL-Yageo-datasheet-98239111.pdf?src-supplier=Upverter; ComponentLink5Description: https://datasheet.octopart.com:443/RC0805FR-0710KL-Yageo-datasheet-98239111.pdf?src-supplier=Upverter; ComponentLink6URL: https://datasheet.octopart.com:443/RC0805FR-0710KL-Yageo---Phycomp-datasheet-67302840.pdf?src-supplier=Upverter; ComponentLink6Description: https://datasheet.octopart.com:443/RC0805FR-0710KL-Yageo---Phycomp-datasheet-67302840.pdf?src-supplier=Upverter; ComponentLink7URL: https://datasheet.octopart.com:443/RC0805FR-0710KL-Yageo-datasheet-8330313.pdf?src-supplier=element14+APAC; ComponentLink7Description: https://datasheet.octopart.com:443/RC0805FR-0710KL-Yageo-datasheet-8330313.pdf?src-supplier=element14+APAC; ComponentLink8URL: https://datasheet.octopart.com:443/RC0805FR-0710KL-Yageo-datasheet-12592811.pdf?src-supplier=element14+APAC; ComponentLink8Description: https://datasheet.octopart.com:443/RC0805FR-0710KL-Yageo-datasheet-12592811.pdf?src-supplier=element14+APAC; ComponentLink9URL: https://datasheet.octopart.com:443/RC0805FR-0710KL-Yageo-Group-datasheet-190305687.pdf?src-supplier=Future+Electronics; ComponentLink9Description: https://datasheet.octopart.com:443/RC0805FR-0710KL-Yageo-Group-datasheet-190305687.pdf?src-supplier=Future+Electronics; ComponentLink10URL: https://datasheet.octopart.com:443/RC0805FR-0710KL-Yageo-datasheet-164759695.pdf?src-supplier=Future+Electronics; ComponentLink10Description: https://datasheet.octopart.com:443/RC0805FR-0710KL-Yageo-datasheet-164759695.pdf?src-supplier=Future+Electronics; ComponentLink11URL: https://datasheet.octopart.com:443/RC0805FR-0710KL-Yageo-datasheet-15800360.pdf?src-supplier=Future+Electronics; ComponentLink11Description: https://datasheet.octopart.com:443/RC0805FR-0710KL-Yageo-datasheet-15800360.pdf?src-supplier=Future+Electronics; ComponentLink12URL: https://datasheet.octopart.com:443/RC0805FR-0710KL-Yageo-datasheet-8324252.pdf?src-supplier=Future+Electronics; ComponentLink12Description: https://datasheet.octopart.com:443/RC0805FR-0710KL-Yageo-datasheet-8324252.pdf?src-supplier=Future+Electronics; ComponentLink13URL: https://datasheet.octopart.com:443/RC0805FR-0710KL-Yageo-datasheet-79472498.pdf?src-supplier=Megastar; ComponentLink13Description: https://datasheet.octopart.com:443/RC0805FR-0710KL-Yageo-datasheet-79472498.pdf?src-supplier=Megastar; ComponentLink14URL: https://datasheet.octopart.com:443/RC0805FR-0710KL-Yageo-datasheet-27714392.pdf?src-supplier=Seeed+Studio; ComponentLink14Description: https://datasheet.octopart.com:443/RC0805FR-0710KL-Yageo-datasheet-27714392.pdf?src-supplier=Seeed+Studio; ComponentLink15URL: https://datasheet.octopart.com/RC0805FR-0710KL-Yageo-datasheet-73766026.pdf; ComponentLink15Description: https://datasheet.octopart.com/RC0805FR-0710KL-Yageo-datasheet-73766026.pdf; ComponentLink16URL: https://datasheet.octopart.com:443/RC0805FR-0710KL-Yageo-datasheet-118657.pdf?src-supplier=DigiKey; ComponentLink16Description: https://datasheet.octopart.com:443/RC0805FR-0710KL-Yageo-datasheet-118657.pdf?src-supplier=DigiKey; ComponentLink17URL: https://datasheet.octopart.com:443/RC0805FR-0710KL-Yageo-datasheet-502840.pdf?src-supplier=element14; ComponentLink17Description: https://datasheet.octopart.com:443/RC0805FR-0710KL-Yageo-datasheet-502840.pdf?src-supplier=element14; ComponentLink18URL: http://sigma.octopart.com:80/conflict_mineral_statement/Yageo-company-3.pdf?src-supplier=Compliance+Statements; ComponentLink18Description: http://sigma.octopart.com:80/conflict_mineral_statement/Yageo-company-3.pdf?src-supplier=Compliance+Statements; ComponentLink19URL: http://sigma.octopart.com:80/rohs_statement/Yageo-company-2.pdf?src-supplier=Compliance+Statements; ComponentLink19Description: http://sigma.octopart.com:80/rohs_statement/Yageo-company-2.pdf?src-supplier=Compliance+Statements; LCSC Part No: C84376
R4 = RC0805FR-071KL: Yageo RC0805FR-071KL SMD Resistor 0603 1k Ohm ±1% Thick Film; Manufacturer: Yageo Group; Max Power Dissipation: 125mW; Value: 1kΩ; Temperature Coefficient: 100ppm/°C; Voltage Rating: 150V; Supplier: Future Electronics; Supplier Part Number: RC0805FR-071KL; Manufacturer Part Number: RC0805FR-071KL; RoHS: Compliant; Category: Chip SMD Resistors; Stock: 3035000; Pricing: 10000=0.0017, 50000=0.0017, 150000=0.0016, 375000=0.0016, 1000000=0.0015 (USD); Case/Package: 0805; Case Code (Imperial): 0805; China RoHS: Non-Compliant; Composition: Thick Film; Contact Plating: Tin; Country of Origin: Mainland China, Taiwan; Depth: 1.25mm; Export Control Classification Number (ECCN) Code: EAR99; Features: Moisture Resistant; Height: 500µm; Harmonized Tariff Schedule (HTS) Code: 8533.21.00.30; Introduction Date: 2004-09-22; Lead Free: Lead Free; Length: 2mm; Lifecycle Status: Production; Max Operating Temperature: 155°C; Military Standard: Not; Min Operating Temperature: -55°C; Mounting Technology: Surface Mount; Pins: 2; Number of Terminals: 2; Number of Terminations: 2; Packaging: Tape & Reel; Power Rating: 125mW; Radiation Hardening: No; REACH SVHC: Yes; Schedule B: 8533210045, 8533210045|8533210045, 8533210045|8533210045|8533210045, 8533210045|8533210045|8533210045|8533210045; Termination: SMD/SMT; Tolerance: 1%; Voltage Rating (AC): 150V; Voltage Rating (DC): 150V; Width: 1.25mm; Working Voltage: 150V; ComponentLink1URL: https://datasheet.octopart.com:443/RC0805FR-071KL-Yageo-datasheet-175887523.pdf?src-supplier=IHS; ComponentLink1Description: https://datasheet.octopart.com:443/RC0805FR-071KL-Yageo-datasheet-175887523.pdf?src-supplier=IHS; ComponentLink2URL: https://datasheet.octopart.com:443/RC0805FR-071KL-Yageo-datasheet-103092701.pdf?src-supplier=Upverter; ComponentLink2Description: https://datasheet.octopart.com:443/RC0805FR-071KL-Yageo-datasheet-103092701.pdf?src-supplier=Upverter; ComponentLink3URL: https://datasheet.octopart.com:443/RC0805FR-071KL-Yageo-datasheet-8330313.pdf?src-supplier=element14+APAC; ComponentLink3Description: https://datasheet.octopart.com:443/RC0805FR-071KL-Yageo-datasheet-8330313.pdf?src-supplier=element14+APAC; ComponentLink4URL: https://datasheet.octopart.com:443/RC0805FR-071KL-Yageo-datasheet-62067350.pdf?src-supplier=element14+APAC; ComponentLink4Description: https://datasheet.octopart.com:443/RC0805FR-071KL-Yageo-datasheet-62067350.pdf?src-supplier=element14+APAC; ComponentLink5URL: https://datasheet.octopart.com:443/RC0805FR-071KL-Yageo-datasheet-12592811.pdf?src-supplier=element14+APAC; ComponentLink5Description: https://datasheet.octopart.com:443/RC0805FR-071KL-Yageo-datasheet-12592811.pdf?src-supplier=element14+APAC; ComponentLink6URL: https://datasheet.octopart.com:443/RC0805FR-071KL-Yageo-Group-datasheet-190305687.pdf?src-supplier=Newark; ComponentLink6Description: https://datasheet.octopart.com:443/RC0805FR-071KL-Yageo-Group-datasheet-190305687.pdf?src-supplier=Newark; ComponentLink7URL: https://datasheet.octopart.com:443/RC0805FR-071KL-Yageo-Group-datasheet-176638170.pdf?src-supplier=Future+Electronics; ComponentLink7Description: https://datasheet.octopart.com:443/RC0805FR-071KL-Yageo-Group-datasheet-176638170.pdf?src-supplier=Future+Electronics; ComponentLink8URL: https://datasheet.octopart.com:443/RC0805FR-071KL-Yageo-datasheet-164759695.pdf?src-supplier=Future+Electronics; ComponentLink8Description: https://datasheet.octopart.com:443/RC0805FR-071KL-Yageo-datasheet-164759695.pdf?src-supplier=Future+Electronics; ComponentLink9URL: https://datasheet.octopart.com:443/RC0805FR-071KL-Yageo-datasheet-8324252.pdf?src-supplier=Future+Electronics; ComponentLink9Description: https://datasheet.octopart.com:443/RC0805FR-071KL-Yageo-datasheet-8324252.pdf?src-supplier=Future+Electronics; ComponentLink10URL: https://datasheet.octopart.com:443/RC0805FR-071KL-Yageo-datasheet-79472498.pdf?src-supplier=Megastar; ComponentLink10Description: https://datasheet.octopart.com:443/RC0805FR-071KL-Yageo-datasheet-79472498.pdf?src-supplier=Megastar; ComponentLink11URL: https://datasheet.octopart.com/RC0805FR-071KL-Yageo-datasheet-73766026.pdf; ComponentLink11Description: https://datasheet.octopart.com/RC0805FR-071KL-Yageo-datasheet-73766026.pdf; ComponentLink12URL: https://datasheet.octopart.com:443/RC0805FR-071KL-Yageo-datasheet-13691069.pdf?src-supplier=Farnell; ComponentLink12Description: https://datasheet.octopart.com:443/RC0805FR-071KL-Yageo-datasheet-13691069.pdf?src-supplier=Farnell; ComponentLink13URL: https://datasheet.octopart.com:443/RC0805FR-071KL-Yageo-datasheet-118657.pdf?src-supplier=DigiKey; ComponentLink13Description: https://datasheet.octopart.com:443/RC0805FR-071KL-Yageo-datasheet-118657.pdf?src-supplier=DigiKey; ComponentLink14URL: https://datasheet.octopart.com:443/RC0805FR-071KL-Yageo-datasheet-502840.pdf?src-supplier=element14; ComponentLink14Description: https://datasheet.octopart.com:443/RC0805FR-071KL-Yageo-datasheet-502840.pdf?src-supplier=element14; ComponentLink15URL: http://sigma.octopart.com:80/conflict_mineral_statement/Yageo-company-3.pdf?src-supplier=Compliance+Statements; ComponentLink15Description: http://sigma.octopart.com:80/conflict_mineral_statement/Yageo-company-3.pdf?src-supplier=Compliance+Statements; ComponentLink16URL: http://sigma.octopart.com:80/rohs_statement/Yageo-company-2.pdf?src-supplier=Compliance+Statements; ComponentLink16Description: http://sigma.octopart.com:80/rohs_statement/Yageo-company-2.pdf?src-supplier=Compliance+Statements; LCSC Part No: C95781
T1 = SUP90P06-09L-E3: Transistor MOSFET P-CH 60V 90A 3-Pin (3+Tab) TO-220AB; Manufacturer: Vishay; Drain to Source Breakdown Voltage: -60V; Drain to Source Resistance: 9.3mΩ; Element Configuration: Single; Fall Time: 300ns; Gate to Source Voltage (Vgs): 20V; Input Capacitance: 9.2nF; Max Junction Temperature (Tj): 175°C; Max Power Dissipation: 250W; Number of Channels: 1; Power Dissipation: 2.4W; Value: 9.3mΩ; Rise Time: 190ns; Threshold Voltage: -1V; Turn-Off Delay Time: 140ns; Turn-On Delay Time: 20ns; Supplier: Future Electronics; Supplier Part Number: SUP90P06-09L-E3; Manufacturer Part Number: SUP90P06-09L-E3; RoHS: Compliant; Category: MOSFETs; Stock: 50; Pricing: 50=5.68, 100=5.65, 200=5.62, 750=5.56 (USD); Case/Package: TO-220AB; China RoHS: Non-Compliant; Contact Plating: Tin; Continuous Drain Current (ID): 90A; Country of Origin: Israel; Drain to Source Voltage (Vdss): -60V; Export Control Classification Number (ECCN) Code: EAR99; Height: 19.31mm; Harmonized Tariff Schedule (HTS) Code: 8541.29.00.95; Introduction Date: 2004-06-15; Lead Free: Lead Free; Length: 10.41mm; Lifecycle Status: Production; Max Operating Temperature: 175°C; Min Breakdown Voltage: 60V; Min Operating Temperature: -55°C; Mounting Technology: Through Hole; Number of Elements: 1; Pins: 3; Number of Terminals: 3; Radiation Hardening: No; Rds On Max: 9.3mΩ; REACH SVHC: No; Schedule B: 8541290080, 8541290080|8541290080|8541290080|8541290080|8541290080; Weight: 6.000006g; Width: 4.7mm; ComponentLink1URL: https://datasheet.octopart.com:443/SUP90P06-09L-E3-Vishay-datasheet-136806930.pdf?src-supplier=Upverter; ComponentLink1Description: https://datasheet.octopart.com:443/SUP90P06-09L-E3-Vishay-datasheet-136806930.pdf?src-supplier=Upverter; ComponentLink2URL: https://datasheet.octopart.com:443/SUP90P06-09L-E3-Vishay-datasheet-181475598.pdf?src-supplier=Farnell; ComponentLink2Description: https://datasheet.octopart.com:443/SUP90P06-09L-E3-Vishay-datasheet-181475598.pdf?src-supplier=Farnell; ComponentLink3URL: https://datasheet.octopart.com:443/SUP90P06-09L-E3-Vishay-datasheet-5331994.pdf?src-supplier=Farnell; ComponentLink3Description: https://datasheet.octopart.com:443/SUP90P06-09L-E3-Vishay-datasheet-5331994.pdf?src-supplier=Farnell; ComponentLink4URL: https://datasheet.octopart.com:443/SUP90P06-09L-E3-Vishay-datasheet-12554124.pdf?src-supplier=Farnell; ComponentLink4Description: https://datasheet.octopart.com:443/SUP90P06-09L-E3-Vishay-datasheet-12554124.pdf?src-supplier=Farnell; ComponentLink5URL: https://datasheet.octopart.com:443/SUP90P06-09L-E3-Vishay-datasheet-62319295.pdf?src-supplier=element14+APAC; ComponentLink5Description: https://datasheet.octopart.com:443/SUP90P06-09L-E3-Vishay-datasheet-62319295.pdf?src-supplier=element14+APAC; ComponentLink6URL: https://datasheet.octopart.com:443/SUP90P06-09L-E3-Vishay-datasheet-34182708.pdf?src-supplier=Newark; ComponentLink6Description: https://datasheet.octopart.com:443/SUP90P06-09L-E3-Vishay-datasheet-34182708.pdf?src-supplier=Newark; ComponentLink7URL: https://datasheet.octopart.com:443/SUP90P06-09L-E3-Vishay-datasheet-182948809.pdf?src-supplier=Future+Electronics; ComponentLink7Description: https://datasheet.octopart.com:443/SUP90P06-09L-E3-Vishay-datasheet-182948809.pdf?src-supplier=Future+Electronics; ComponentLink8URL: https://datasheet.octopart.com:443/SUP90P06-09L-E3-Vishay-datasheet-44060369.pdf?src-supplier=TME; ComponentLink8Description: https://datasheet.octopart.com:443/SUP90P06-09L-E3-Vishay-datasheet-44060369.pdf?src-supplier=TME; ComponentLink9URL: https://datasheet.octopart.com:443/SUP90P06-09L-E3-Vishay-datasheet-7828879.pdf?src-supplier=Jameco; ComponentLink9Description: https://datasheet.octopart.com:443/SUP90P06-09L-E3-Vishay-datasheet-7828879.pdf?src-supplier=Jameco; ComponentLink10URL: http://sigma.octopart.com:80/rohs_statement/Vishay-company-15.pdf?src-supplier=Compliance+Statements; ComponentLink10Description: http://sigma.octopart.com:80/rohs_statement/Vishay-company-15.pdf?src-supplier=Compliance+Statements; LCSC Part No: C913431